# Altium schematic sheet usb-debug.SchDoc
size A3; DocumentNumber: 6; SheetNumber: 6; SheetTotal: 6; PageSetup: Record=PageOptions|CenterHorizontal=True|CenterVertical=True|PrintScale=0.97|XCorrection=1.00|YCorrection=1.00|PrintKind=1|BorderSize=5000000|LeftOffset=0|BottomOffset=0|Orientation=2|PaperLength=2970|PaperWidth=2100|Scale=100|PaperSource=7|PrintQuality=600|MediaType=1|DitherType=10|PaperKind=A4|PrintScaleMode=1
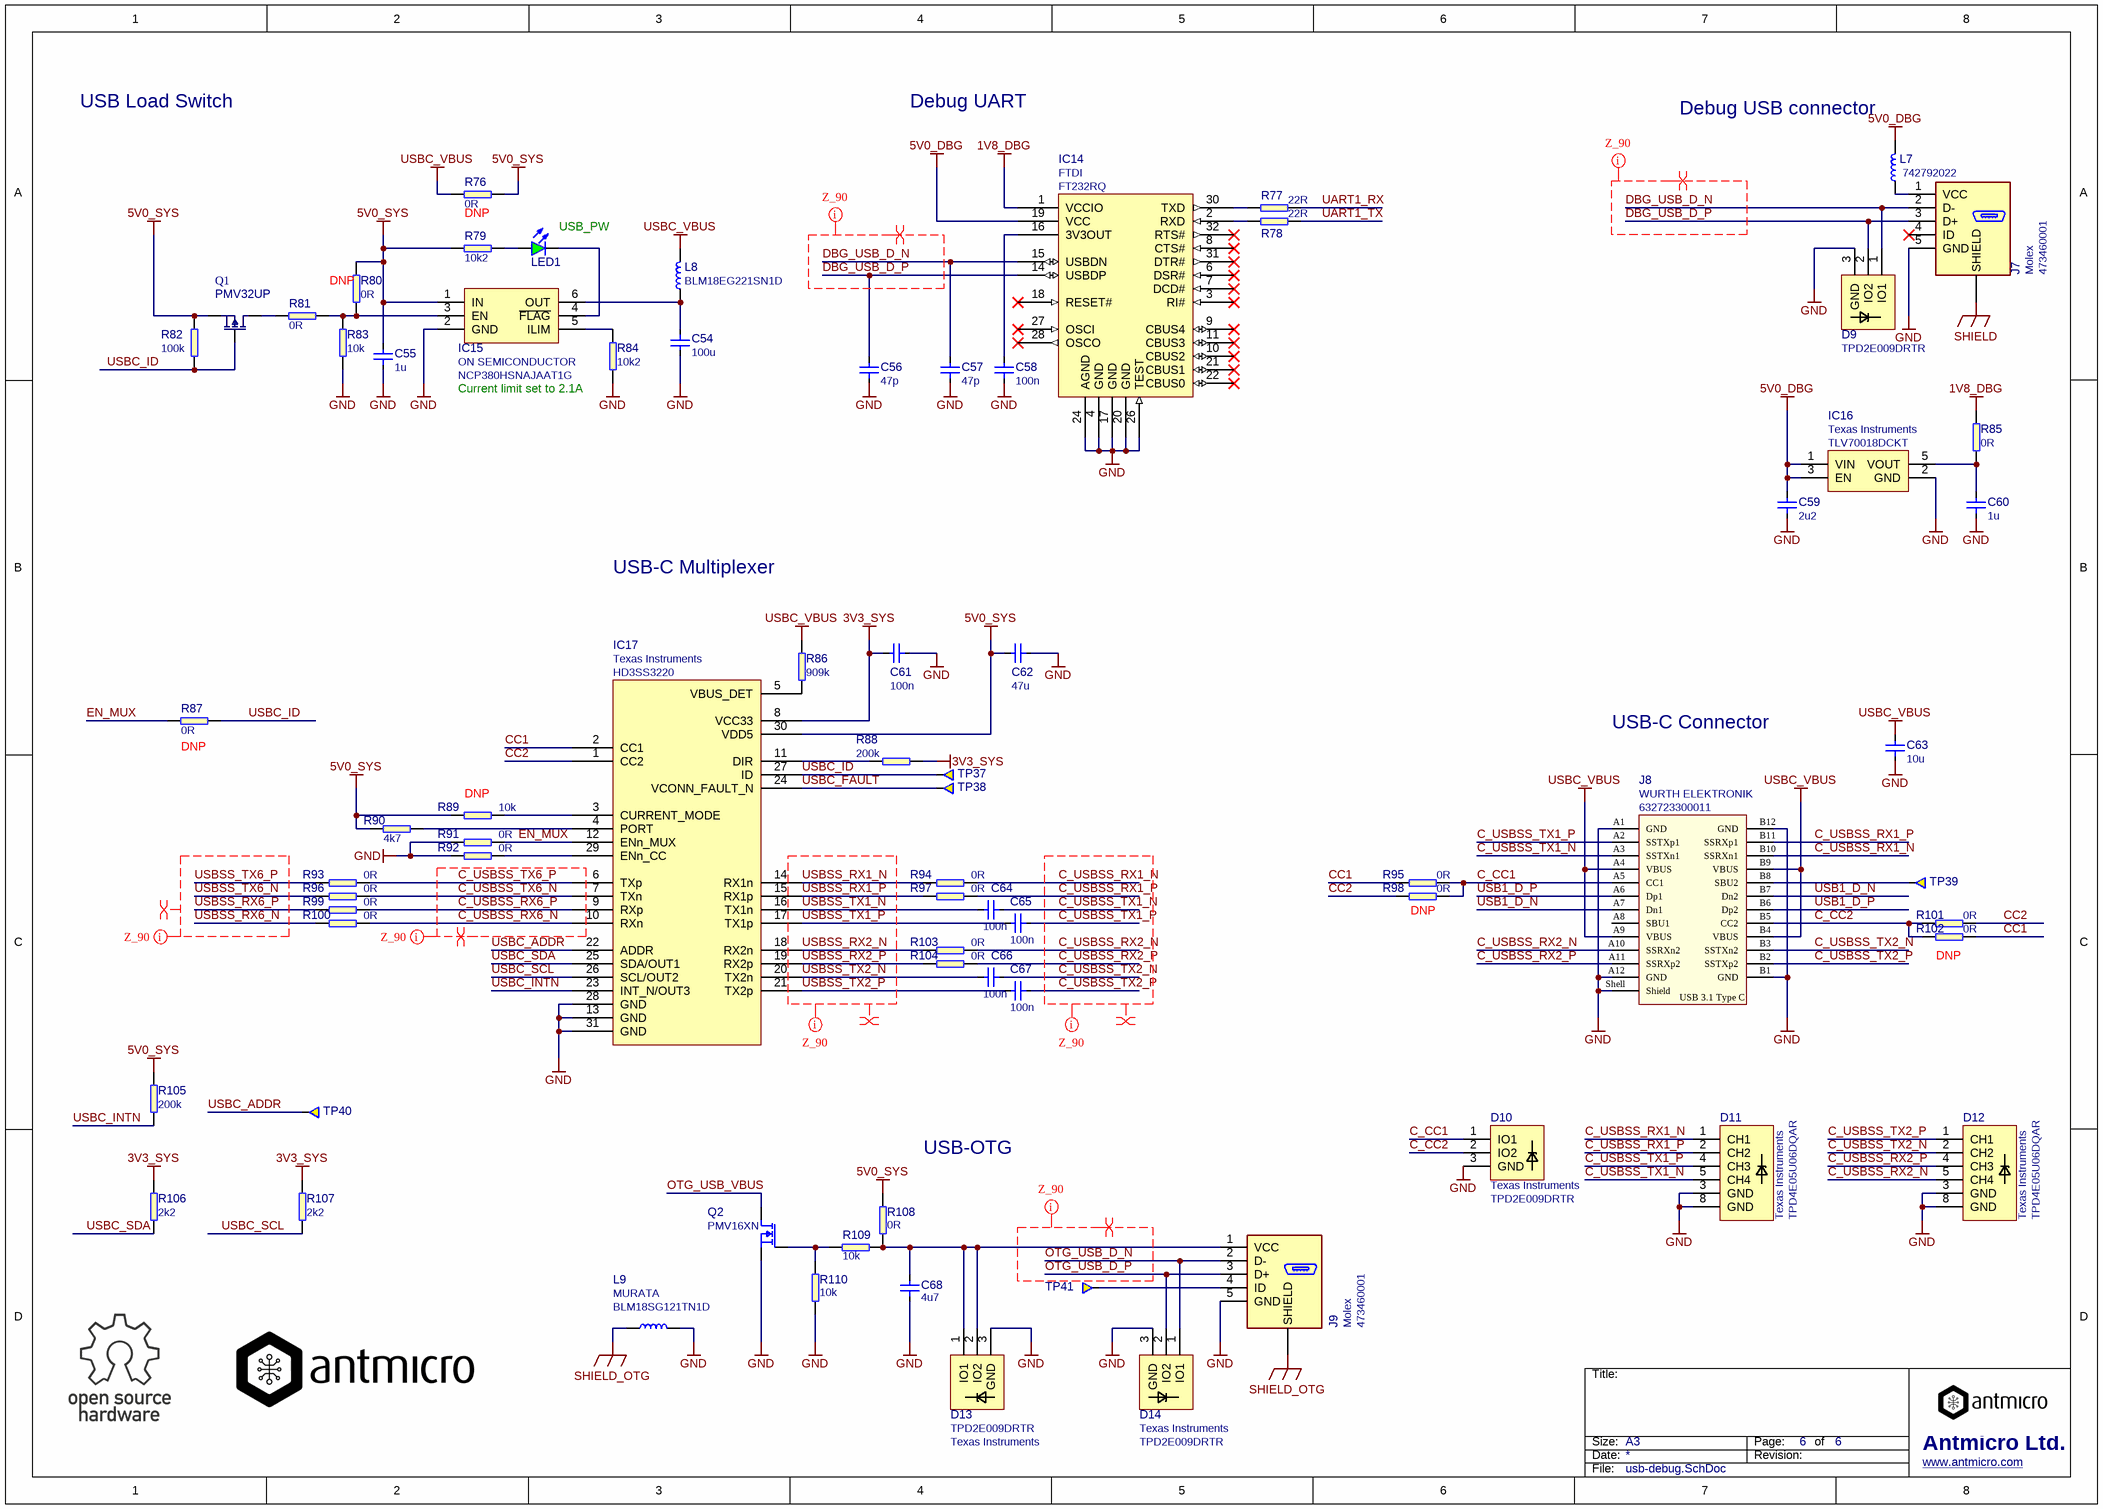
[diagram p0: usb-debug.SchDoc]

## Parts
C54  100u  [1210]
C55  1u  [0603]
C56  47p  [0603]
C57  47p  [0603]
C58  100n  [0603]
C59  2u2  [0402]
C60  1u  [0402]
C61  100n  [0603]
C62  47u  [0805]
C63  10u  [0603]
C64  100n  [0402]
C65  100n  [0402]
C66  100n  [0402]
C67  100n  [0402]
C68  4u7  [0603]
D9  TPD2E009DRTR  [SOT-3]
D10  TPD2E009DRTR  Manufacturer: Texas Instruments  [SOT-3]
D11  Manufacturer: Texas Instruments  PartSymbol: TPD4E05U06DQAR  [TPD4E05U06_PASS]  (hidden comment: TPD4E05U06)
D12  Manufacturer: Texas Instruments  PartSymbol: TPD4E05U06DQAR  [TPD4E05U06_PASS]  (hidden comment: TPD4E05U06)
D13  TPD2E009DRTR  Manufacturer: Texas Instruments  [SOT-3]
D14  TPD2E009DRTR  Manufacturer: Texas Instruments  [SOT-3]
IC14  Manufacturer: FTDI  [QFN-32]  (hidden comment: FT232RQ)
IC15  NCP380HSNAJAAT1G  Manufacturer: ON SEMICONDUCTOR  [TSOP-6]
IC16  TLV70018DCKT  Manufacturer: Texas Instruments  [SC70-5]
IC17  HD3SS3220  Manufacturer: Texas Instruments  [RNH0030A]
J7  Manufacturer: Molex  PartSymbol: 473460001  [CON-Molex-047346-0001]  (hidden comment: Molex 47346-0001)
J8  632723300011  Manufacturer: WURTH ELEKTRONIK  [WE_632723300011]
J9  Manufacturer: Molex  PartSymbol: 473460001  [CON-Molex-047346-0001]  (hidden comment: Molex 47346-0001)
L7  742792022  [0805]
L8  BLM18EG221SN1D  [0603]
L9  BLM18SG121TN1D  Manufacturer: MURATA  [0603]
LED1  KPT-1608SGC  [LED0603]  (value not drawn)
Q1  PMV32UP  [SOT-23]
Q2  PMV16XN  [SOT-23]
R76  0R  [0603]
R77  22R  [0402]
R78  22R  [0402]
R79  10k2  [0603]
R80  0R  [0402]
R81  0R  [0402]
R82  100k  [0603]
R83  10k  [0402]
R84  10k2  [0603]
R85  0R  [0603]
R86  909k  [0402]
R87  0R  [0402]
R88  200k  [0402]
R89  10k  [0402]
R90  4k7  [0402]
R91  0R  [0402]
R92  0R  [0402]
R93  0R  [0402]
R94  0R  [0402]
R95  0R  [0402]
R96  0R  [0402]
R97  0R  [0402]
R98  0R  [0402]
R99  0R  [0402]
R100  0R  [0402]
R101  0R  [0402]
R102  0R  [0402]
R103  0R  [0402]
R104  0R  [0402]
R105  200k  [0402]
R106  2k2  [0402]
R107  2k2  [0402]
R108  0R  [0402]
R109  10k  [0402]
R110  10k  [0402]
TP37  Testpad  [TP-R-1.5]  (value not drawn)  (no BOM)
TP38  Testpad  [TP-R-1.5]  (value not drawn)  (no BOM)
TP39  Testpad  [TP-R-1.5]  (value not drawn)  (no BOM)
TP40  Testpad  [TP-R-1.5]  (value not drawn)  (no BOM)
TP41  Testpad  [TP-R-1.5]  (value not drawn)  (no BOM)

## Nets
1V8_DBG: IC14.1(VCCIO) R85.2
3V3_SYS: C61.2 IC17.8(VCC33) R88.2 R106.2 R107.2
5V0_DBG: C59.2 IC14.19(VCC) IC16.1(VIN) IC16.3(EN) L7.2
5V0_SYS: C55.2 C62.2 IC15.1(IN) IC17.30(VDD5) Q1.2(S) R76.2 R79.2 R80.2 R82.1 R89.1 R90.1 R105.2 R108.2
GND: C54.2 C55.1 C56.1 C57.1 C58.1 C59.1 C60.1 C61.1 C62.1 C63.1 C68.1 D9.3(GND) D10.3(GND) D11.3(GND) D11.8(GND) D12.3(GND) D12.8(GND) D13.3(GND) D14.3(GND) IC14.4(GND) IC14.17(GND) IC14.20(GND) IC14.24(AGND) IC14.26(TEST) IC15.2(GND) IC16.2(GND) IC17.13(GND) IC17.28(GND) IC17.31(GND) J7.5(GND) J8.A1(GND) J8.A12(GND) J8.B1(GND) J8.B12(GND) J8.Shell(Shield) J9.5(GND) L9.2 Q2.2(S) R83.1 R84.1 R91.1 R92.1 R110.1
SHIELD: J7.S(SHIELD)
SHIELD_OTG: J9.S(SHIELD) L9.1
USBC_VBUS: C63.2 J8.A4(VBUS) J8.A9(VBUS) J8.B4(VBUS) J8.B9(VBUS) L8.2 R76.1 R86.2
C_CC1: D10.1(IO1) J8.A5(CC1) R95.2 R98.2
C_CC2: D10.2(IO2) J8.B5(CC2) R101.1 R102.1
C_USBSS_RX1_N: D11.1(CH1) J8.B10(SSRXn1) R94.2
C_USBSS_RX1_P: D11.2(CH2) J8.B11(SSRXp1) R97.2
C_USBSS_RX2_N: D12.5(CH4) J8.A10(SSRXn2) R103.2
C_USBSS_RX2_P: D12.4(CH3) J8.A11(SSRXp2) R104.2
C_USBSS_RX6_N: IC17.10(RXn) R100.2
C_USBSS_RX6_P: IC17.9(RXp) R99.2
C_USBSS_TX1_N: C64.1 D11.5(CH4) J8.A3(SSTXn1)
C_USBSS_TX1_P: C65.1 D11.4(CH3) J8.A2(SSTXp1)
C_USBSS_TX2_N: C66.1 D12.2(CH2) J8.B3(SSTXn2)
C_USBSS_TX2_P: C67.1 D12.1(CH1) J8.B2(SSTXp2)
C_USBSS_TX6_N: IC17.7(TXn) R96.2
C_USBSS_TX6_P: IC17.6(TXp) R93.2
CC1: IC17.2(CC1) R95.1 R102.2
CC2: IC17.1(CC2) R98.1 R101.2
DBG_USB_D_N: C57.2 D9.1(IO1) IC14.15(USBDN) J7.2(D-)
DBG_USB_D_P: C56.2 D9.2(IO2) IC14.14(USBDP) J7.3(D+)
EN_MUX: IC17.12(ENn_MUX) R87.1 R91.2
OTG_USB_D_N: D14.1(IO1) J9.2(D-)
OTG_USB_D_P: D14.2(IO2) J9.3(D+)
OTG_USB_VBUS: Q2.3(D)
UART1_RX: R77.2
UART1_TX: R78.2
USB1_D_N: J8.A7(Dn1) J8.B7(Dn2)
USB1_D_P: J8.A6(Dp1) J8.B6(Dp2)
USBC_ADDR: IC17.22(ADDR) TP40.1
USBC_FAULT: IC17.24(VCONN_FAULT_N) TP38.1
USBC_ID: IC17.27(ID) Q1.1(G) R82.2 R87.2 TP37.1
USBC_INTN: IC17.23(INT_N/OUT3) R105.1
USBC_SCL: IC17.26(SCL/OUT2) R107.1
USBC_SDA: IC17.25(SDA/OUT1) R106.1
USBSS_RX1_N: IC17.14(RX1n) R94.1
USBSS_RX1_P: IC17.15(RX1p) R97.1
USBSS_RX2_N: IC17.18(RX2n) R103.1
USBSS_RX2_P: IC17.19(RX2p) R104.1
USBSS_RX6_N: R100.1
USBSS_RX6_P: R99.1
USBSS_TX1_N: C64.2 IC17.16(TX1n)
USBSS_TX1_P: C65.2 IC17.17(TX1p)
USBSS_TX2_N: C66.2 IC17.20(TX2n)
USBSS_TX2_P: C67.2 IC17.21(TX2p)
USBSS_TX6_N: R96.1
USBSS_TX6_P: R93.1
NetC54_1: C54.1 IC15.6(OUT) L8.1
NetC58_2: C58.2 IC14.16(3V3OUT)
NetC60_2: C60.2 IC16.5(VOUT) R85.1
NetC68_2: C68.2 D13.1(IO1) D13.2(IO2) J9.1(VCC) R108.1 R109.1
NetIC14_2: IC14.2(RXD) R78.1
NetIC14_30: IC14.30(TXD) R77.1
NetIC15_3: IC15.3(EN) R80.1 R81.2 R83.2
NetIC15_4: IC15.4(~{FLAG}) LED1.K
NetIC15_5: IC15.5(ILIM) R84.2
NetIC17_3: IC17.3(CURRENT_MODE) R89.2
NetIC17_4: IC17.4(PORT) R90.2
NetIC17_5: IC17.5(VBUS_DET) R86.1
NetIC17_11: IC17.11(DIR) R88.1
NetIC17_29: IC17.29(ENn_CC) R92.2
NetJ7_1: J7.1(VCC) L7.1
NetJ8_B8: J8.B8(SBU2) TP39.1
NetJ9_4: J9.4(ID) TP41.1
NetLED1_A: LED1.A R79.1
NetQ1_3: Q1.3(D) R81.1
NetQ2_1: Q2.1(G) R109.2 R110.2

Not connected (* = marked no-connect by the designer): IC14 3(RI#)* 6(DSR#)* 7(DCD#)* 8(CTS#)* 9(CBUS4)* 10(CBUS2)* 11(CBUS3)* 18(RESET#)* 21(CBUS1)* 22(CBUS0)* 27(OSCI)* 28(OSCO)* 31(DTR#)* 32(RTS#)*; J7 4(ID)*; J8 A8(SBU1)

## Layout directives
differential pair: C_USBSS_RX1_N, C_USBSS_RX1_P, C_USBSS_RX2_N, C_USBSS_RX2_P, C_USBSS_RX6_N, C_USBSS_RX6_P, C_USBSS_TX1_N, C_USBSS_TX1_P, C_USBSS_TX2_N, C_USBSS_TX2_P, C_USBSS_TX6_N, C_USBSS_TX6_P, DBG_USB_D_N, DBG_USB_D_P, OTG_USB_D_N, OTG_USB_D_P, USBSS_RX1_N, USBSS_RX1_P, USBSS_RX2_N, USBSS_RX2_P, USBSS_RX6_N, USBSS_RX6_P, USBSS_TX1_N, USBSS_TX1_P, USBSS_TX2_N, USBSS_TX2_P, USBSS_TX6_N, USBSS_TX6_P
net class Z_90: C_USBSS_RX1_N, C_USBSS_RX1_P, C_USBSS_RX2_N, C_USBSS_RX2_P, C_USBSS_RX6_N, C_USBSS_RX6_P, C_USBSS_TX1_N, C_USBSS_TX1_P, C_USBSS_TX2_N, C_USBSS_TX2_P, C_USBSS_TX6_N, C_USBSS_TX6_P, DBG_USB_D_N, DBG_USB_D_P, OTG_USB_D_N, OTG_USB_D_P, USBSS_RX1_N, USBSS_RX1_P, USBSS_RX2_N, USBSS_RX2_P, USBSS_RX6_N, USBSS_RX6_P, USBSS_TX1_N, USBSS_TX1_P, USBSS_TX2_N, USBSS_TX2_P, USBSS_TX6_N, USBSS_TX6_P

## Notes on the sheet
- USB Load Switch
- Debug UART
- (near L7) Debug USB connector
- (near R76) DNP
- (near LED1) USB_PW
- (near R80) DNP
- (near R84) Current limit set to 2.1A
- USB-C Multiplexer
- (near R87) DNP
- USB-C Connector
- (near R89) DNP
- (near R98) DNP
- (near R102) DNP
- USB-OTG
- Title:
- Size:
- Date:
- A3
- Revision:
- Page:
- of
- Antmicro Ltd.
- File:
- www.antmicro.com
- (in symbol WE_632723300011) USB 3.1 Type C

## Library data of the parts
C54 = C_100u_1210: MLCC SMT Capacitor 100uF 1210; Manufacturer: SAMSUNG; PartSymbol: CL32A107MQVNNNE; Value: 100u; PartNumber: C_100u_1210
C55 = C_1u_0603: MLCC SMT Capacitor 1uF 0603; Manufacturer: KEMET; PartSymbol: C0603C105M4PACTU; Value: 1u; PartNumber: C_1u_0603
C56 C57 = C_47p_0603: MLCC SMT Capacitor 47pF 0603; Manufacturer: AVX; PartSymbol: 06031A470KAT2A; Value: 47p; PartNumber: C_47p_0603
C58 C61 = C_100n_0603: MLCC SMT Capacitor 100nF 0603; Manufacturer: AVX; PartSymbol: 0603YC104KAZ2A; Value: 100n; PartNumber: C_100n_0603
C59 = C_2u2_0402: MLCC SMT Capacitor 2.2uF 0402; Manufacturer: TDK; PartSymbol: C1005X5R1A225K050BC; Value: 2u2; PartNumber: C_2u2_0402
C60 = C_1u_0402: MLCC SMT Capacitor 1uF 0402; Manufacturer: MULTICOMP; PartSymbol: MC0402F105Z6R3CT; Value: 1u; PartNumber: C_1u_0402
C62 = C_47u_0805: MLCC SMT Capacitor 47uF 0805; Manufacturer: KEMET; PartSymbol: C0805C476M9PACTU; PartNumber: C_47u_0805; Value: 47u
C63 = C_10u_0603: MLCC SMT Capacitor 10uF 0603; Manufacturer: Walsin; PartSymbol: 0603X106M6R3CT; PartNumber: C_10u_0603; Value: 10u
C64-C67 = C_100n_0402: MLCC SMT Capacitor 100n 0402; Manufacturer: TDK; PartSymbol: C1005X5R0J104K050BA; Value: 100n; PartNumber: C_100n_0402
C68 = C_4u7_0603: MLCC SMT Capacitor 4.7uF 0603; Manufacturer: MULTICOMP; PartSymbol: MC0603X475K6R3CT; PartNumber: C_4u7_0603; Value: 4u7
D9 = TPD2E009: ESD Suppressors 2-CH; Manufacturer: Texas Instruments; Value: TPD2E009DRTR; PartNumber: TPD2E009DRTR; PartSymbol: TPD2E009DRTR
D10 D13 D14 = TPD2E009: ESD Suppressors 2-CH; PartNumber: TPD2E009DRTR; Value: TPD2E009DRTR; PartSymbol: TPD2E009DRTR
D11 D12 = TPD4E05U06: ESD Suppressors 4-CH; PartNumber: TPD4E05U06_PASS; Value: TPD4E05U06
IC14 = FT232RQ: USB to serial UART interface; PartSymbol: FT232RQ-REEL; Value: FT232RQ; PartNumber: FT232RQ
IC15 = NCP380HSNAJAAT1G: POWER LOAD SWITCH, HIGH SIDE; Value: NCP380HSNAJAAT1G; PartNumber: NCP380HSNAJAAT1G; PartSymbol: NCP380HSNAJAAT1G
IC16 = TLV700: Voltage Regulator, 2V to 5.5V, 175mV Dropout, 1.8Vout, 200mAout; Value: TLV70018DCKT; PartNumber: TLV70018DCKT; PartSymbol: TLV70018DCKT
IC17 = HD3SS3220: IC DRP PORT CTLR USB-C 30WQFN; PartSymbol: HD3SS3220RNHT; PartNumber: HD3SS3220; Value: HD3SS3220
J7 J9 = Micro USB B: USB - micro B Receptacle Connector 5 Position Surface Mount, Right Angle, Horizontal; PartNumber: CON-Molex-47346-0001; Value: Molex 47346-0001
J8 = WE_632723300011: USB 3.1 Type C Receptacle Horizontal THR WR-COM; PartNumber: WE_632723300011; Value: 632723300011; PartSymbol: 632723300011
L7 = 742792022: MURATA  BLM18EG221SN1D  FERRITE BEAD, 0.05OHM, 2A, 0603; Manufacturer: WURTH ELEKTRONIK; Value: 742792022; PartNumber: 742792022; PartSymbol: 742792022
L8 = BLM18EG221SN1D: MURATA  BLM18EG221SN1D  FERRITE BEAD, 0.05OHM, 2A, 0603; Value: BLM18EG221SN1D; Manufacturer: MURATA; PartNumber: BLM18EG221SN1D; PartSymbol: BLM18EG221SN1D
L9 = BLM18SG121TN1D: FERRITE BEAD, 0.025OHM, 3A, 0603; Value: BLM18SG121TN1D; PartNumber: BLM18SG121TN1D; PartSymbol: BLM18SG121TN1D
LED1 = LED: LED Green 0603 case; Manufacturer: KINGBRIGHT; PartNumber: LED_G; Value: KPT-1608SGC; PartSymbol: KPT-1608SGC
Q1 = PMOS: P CH, 20V, 4A; Manufacturer: NXP; PartNumber: PMV32UP; Value: PMV32UP; PartSymbol: PMV32UP
Q2 = NMOS_PMV16XN: MOSFET, N CH; Manufacturer: NXP; Value: PMV16XN; PartNumber: PMV16XN; PartSymbol: PMV16XN
R76 R85 = R_0R_0603: RES, 0R, 0603; Manufacturer: BOURNS; PartSymbol: CR0603-J/-000ELF; Value: 0R; PartNumber: R_0R_0603
R77 R78 = R_22R_0402: RES, 22R, 0402; Manufacturer: VISHAY; PartSymbol: CRCW040222R0FKED; Value: 22R; PartNumber: R_22R_0402
R79 = R_470R_0603: RES, 470R, 0603; Manufacturer: BOURNS; PartSymbol: CR0603-JW-471GLF; Tolerance: 0.1%; Value: 10k2; PartNumber: R_470R_0603
R80 R81 R87 R91-R104 R108 = R_0R_0402: RES, 0R, 0402; Manufacturer: Panasonic; PartSymbol: ERJ2GE0R00X; PartNumber: R_0R_0402; Value: 0R
R82 = R_100k_0603: RES, 100k, 0603; Manufacturer: BOURNS; PartSymbol: CR0603-FX-1003HLF; Value: 100k; PartNumber: R_100k_0603
R83 R89 R109 R110 = R_10k_0402: RES, 10k, 0402; Manufacturer: MULTICOMP; PartSymbol: MCMR04X1002FTL; Value: 10k; PartNumber: R_10k_0402
R84 = R_5k6_0603: RES, 5k6, 0603; Manufacturer: Panasonic; PartSymbol: ERJ3GEYJ562V; PartNumber: R_5k6_0603; Value: 10k2
R86 = R_909k_0402: RES, 909k, 0402; Manufacturer: Panasonic; PartSymbol: ERJ2RKF9093X; PartNumber: R_909k_0402; Value: 909k
R88 R105 = R_200k_0402: RES, 200k, 0402; Manufacturer: YAGEO; PartSymbol: RC0402FR-07200KL; PartNumber: R_200k_0402; Value: 200k
R90 = R_4k7_0402: RES, 4k7, 0402; Manufacturer: Panasonic; PartSymbol: ERJ2GEJ472X; PartNumber: R_4k7_0402; Value: 4k7
R106 R107 = R_2k2_0402: RES, 2k2, 0402; Manufacturer: MULTICOMP; PartSymbol: MCWR04X2201FTL; PartNumber: R_2k2_0402; Value: 2k2
TP37-TP41 = Testpad: Testpad, round, 1.5mm; PartNumber: TP-R-1.5